# Altium schematic sheet DCDC_Converter.SchDoc
size A4
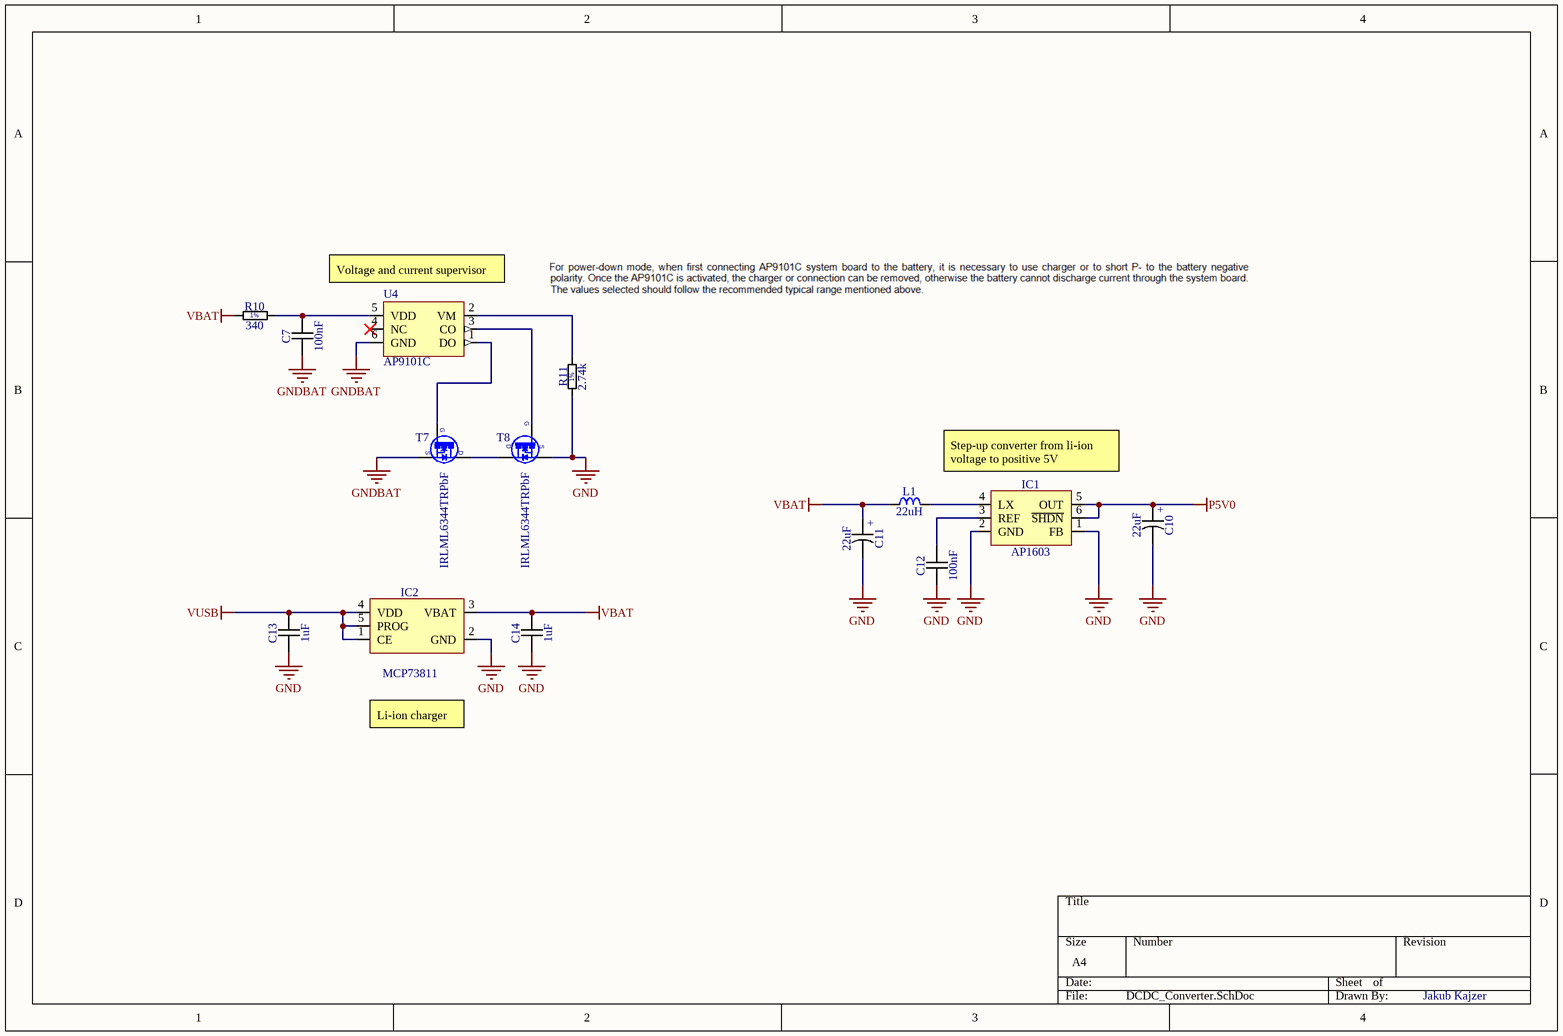
[diagram p0: DCDC_Converter.SchDoc]

## Parts
C7  100nF  [CAPC0402X60N]
C10  22uF  [CAPC2917X310N]
C11  22uF  [CAPC2917X310N]
C12  100nF  [CAPC0603X90N]
C13  1uF  [CAPC0603X90N]
C14  1uF  [CAPC0603X90N]
IC1  AP1603  [SOT26]
IC2  MCP73811  [SOT23-5]
L1  22uH  [INDC1210X150N]
R10  340  [RESC0603X60N]
R11  2.74k  [RESC0603X60N]
T7  IRLML6344TRPbF  [SOT23-3]
T8  IRLML6344TRPbF  [SOT23-3]
U4  AP9101C  [SOT26]

## Nets
GND: C10.2 C11.2 C12.1 C13.1 C14.1 IC1.1(FB) IC1.2(GND) IC2.2(GND) R11.1 T8.2(S)
GNDBAT: C7.1 T7.2(S) U4.6(GND)
P5V0: C10.1 IC1.5(OUT) IC1.6(~{SHDN})
VBAT: C11.1 C14.2 IC2.3(VBAT) L1.1 R10.1
VUSB: C13.2 IC2.1(CE) IC2.4(VDD) IC2.5(PROG)
NetC7_2: C7.2 R10.2 U4.5(VDD)
NetC12_2: C12.2 IC1.3(REF)
NetIC1_4: IC1.4(LX) L1.2
NetR11_2: R11.2 U4.2(VM)
NetT7_1: T7.1(G) U4.1(DO)
NetT7_3: T7.3(D) T8.3(D)
NetT8_1: T8.1(G) U4.3(CO)

Not connected (* = marked no-connect by the designer): U4 4(NC)*

## Notes on the sheet
- Voltage and current supervisor
- Step-up converter from li-ion voltage to positive 5V
- Li-ion charger
- Jakub Kajzer
- (in symbol CC2917_47UF_25V_20%_TANTALUM) +

## Library data of the parts
C7 = CC0402_100NF_16V_10%_X7R: Non-polarised capacitor; Manufacturer: GENERIC; Manufacturer 1 Example: Samsung; Manufacturer 1 Part Number: CL05B104KO5NNNC; Manufacturer 1 Component Height: 0.5mm; PressFit: No; Dielectric: X7R; Tolerance: 10%; Voltage: 16V; DesignItemId: CC0402_100NF_16V_10%_X7R; Author: KB; Case: 0402 (1005 metric); Component Kind: Standard; HelpURL: http://www.farnell.com/datasheets/1870456.pdf?_ga=2.66904750.1666480506.1564307475-778048469.1556931874&_gac=1.242951606.1563147047.EAIaIQobChMIrfuAvMi14wIVB-J3Ch1XegfpEAYYASABEgIMVfD_BwE; Manufacturer Part Number: CC0402_100NF_16V_10%_X7R; Mounted: Yes; Part Description: Non-polarised capacitor; Pin Count: 2; Sense: No; SMD: Yes; Socket: No; Status: Recommended; Value: 100nF; Supplier 1: TME; Supplier 2: Farnell; Supplier 3: Mouser; Create Date: 29.07.2019; LatestRevisionDate: 29.07.2019; Supplier Part Number 1: CL05B104KO5NNNC; Supplier Part Number 2: 1758896; Supplier Part Number 3: 710-885012205037
C10 C11 = CC2917_47UF_25V_20%_TANTALUM: Polarised capacitor; Manufacturer: GENERIC; Manufacturer Part Number: CC2917_22UF_25V_20%_TANTALUM; Manufacturer 1 Example: Vishay; Manufacturer 1 Part Number: 293D476X0025D2TE3; Manufacturer 1 Component Height: 2.8mm; PressFit: No; Tolerance: 20%; Voltage: 25V; DesignItemId: CC2917_47UF_25V_20%_TANTALUM; Author: JK; Case: 2917 (7343 metric); Component Kind: Standard; Footprint: CAPC2917X430N; HelpURL: https://www.tme.eu/Document/a5d90d85079967994fb49c0e8f8ad6e9/293d.pdf; Mounted: Yes; Part Description: Polarised capacitor; Pin Count: 2; Sense: No; SMD: Yes; Socket: No; Status: Recommended; Dielectric: TANTALUM; Value: 22uF; Supplier 1: Mouser; Supplier 2: TME; Create Date: 19.12.2019; LatestRevisionDate: 19.12.2019; Supplier Part Number 1: 74-293D476X0025D2TE3; Supplier Part Number 2: 293D476X0025D2TE3
C12 = CC0603_100NF_16V_10%_X7R: Non-polarised capacitor; Manufacturer: GENERIC; Manufacturer 1 Example: Vishay; Manufacturer 1 Part Number: VJ0603Y104KXJCW1BC; Manufacturer 1 Component Height: 0.8mm; PressFit: No; Dielectric: X7R; Tolerance: 10%; Voltage: 16V; DesignItemId: CC0603_100NF_16V_10%_X7R; Author: KB; Case: 0603 (1608 metric); Component Kind: Standard; HelpURL: https://www.vishay.com/docs/28548/vjw1bcbascomseries.pdf; Manufacturer Part Number: CC0603_100NF_16V_10%_X7R; Mounted: Yes; Part Description: Non-polarised capacitor; Pin Count: 2; Sense: No; SMD: Yes; Socket: No; Status: Recommended; Value: 100nF; Supplier 1: Farnell; Supplier 2: TME; Supplier 3: Mouser; Create Date: 01.04.2019; LatestRevisionDate: 01.04.2019; Supplier Part Number 1: 2896425; Supplier Part Number 2: VJ0603Y104KXJCW1BC; Supplier Part Number 3: 710-885012206046
C13 C14 = CC0603_1UF_6V3_10%_X7R: Non-polarised capacitor; Manufacturer: GENERIC; Manufacturer 1 Example: Samsung; Manufacturer 1 Part Number: C0603C105K9RACAUTO7411; Manufacturer 1 Component Height: 0.8mm; PressFit: No; Dielectric: X7R; Tolerance: 10%; Voltage: 6.3V; DesignItemId: CC0603_1UF_6V3_10%_X7R; Author: UN; Case: 0603 (1608 metric); Component Kind: Standard; HelpURL: https://pl.mouser.com/datasheet/2/212/KEM_C1023_X7R_AUTO_SMD-1093309.pdf; Manufacturer Part Number: CC0603_1UF_6V3_10%_X7R; Mounted: Yes; Part Description: Non-polarised capacitor; Pin Count: 2; Sense: No; SMD: Yes; Socket: No; Status: Recommended; Value: 1uF; Supplier 1: Mouser; Supplier 2: TME; Supplier 3: Farnell; Create Date: 30.08.2019; LatestRevisionDate: 30.08.2019; Supplier Part Number 1: 80-C0603C105K9RAUTLR; Supplier Part Number 2: C0603C105K9RACAU74; Supplier Part Number 3: 2860299
IC1 = AP1603: STEP-UP DC-DC CONVERTER; Manufacturer 1 Example: DIODES INCORPORATED; Manufacturer 1 Part Number: AP1603WG-7; Manufacturer 1 Component Height: 1.3mm; PressFit: No; DesignItemId: AP1603; Author: JK; Device: AP1603; Component Kind: Standard; Footprint: SO26; HelpURL: https://www.tme.eu/Document/3ad0bf81fd35619d65908fe8fa84f929/AP1603x-DTE.pdf; Mounted: Yes; Part Description: STEP-UP DC-DC CONVERTER; Pin Count: 6; Sense: No; SMD: Yes; Socket: No; Supplier 1: Mouser; Supplier 2: Farnell; Supplier 3: TME; Create Date: 19.12.2019; LatestRevisionDate: 19.12.2019; Supplier Part Number 1: 621-AP1603WG-7; Supplier Part Number 2: 1825335; Supplier Part Number 3: AP1603WG-7
IC2 = MCP73811: Simple, Miniature Single-Cell, Fully Integrate d Li-Ion / Li-Polymer Charge Management Controllers; Manufacturer 1 Example: Microchip Technology; Manufacturer 1 Part Number: MCP73811T-420I/OT; Manufacturer 1 Component Height: 1.05mm; PressFit: No; DesignItemId: MCP73811; Author: JK; Device: MCP73811; Component Kind: Standard; HelpURL: https://www.tme.eu/Document/854c2d12dac3548645f8087169cd177d/MCP73811T-420IT.pdf; Mounted: Yes; Part Description: Simple, Miniature Single-Cell, Fully Integrate d Li-Ion / Li-Polymer Charge Management Controllers; Pin Count: 5; Sense: No; SMD: Yes; Socket: No; Supplier 1: TME; Create Date: 20.12.2019; LatestRevisionDate: 20.12.2019; Supplier Part Number 1: MCP73811T-420IT
L1 = IND1210_22UH_150MA: SMD Inductor; Manufacturer: GENERIC; Manufacturer Part Number: LQH32MN220K23L; Manufacturer 1 Example: Murata; Manufacturer 1 Component Height: 2mm; PressFit: No; Tolerance: 10%; DesignItemId: IND1210_22UH_150MA; Author: JK; Case: 1210 (3225 metric); Component Kind: Standard; HelpURL: https://www.murata.com/~/media/webrenewal/support/library/catalog/products/inductor/chip/o05e.ashx; Manufacturer 1 Part Number: LQH32MN220K23L; Mounted: Yes; Part Description: SMD inductor; Pin Count: 2; Sense: No; SMD: Yes; Socket: No; Status: Recommended; Value: 22uH; Supplier 1: Mouser; Supplier 2: TME; Create Date: 19.12.2019; LatestRevisionDate: 19.12.2019; Supplier Part Number 1: 81-LQH32MN220K23L; Supplier Part Number 2: LQH32MN220K23L
R10 = R0603_340R_0.1W_100PPM: General Purpose Thick Film Chip Resistor; Manufacturer: GENERIC; Manufacturer Part Number: R0603_340R_0.0625W 0.1W 0.125W 0.25W 0.5W 1W 0.75W 1W_100PPM; Manufacturer 1 Example: Vishay; Manufacturer 1 Part Number: CRCW0603340RFKEDC; Manufacturer 1 Component Height: 0.5mm; Power: 100mW; Current Max: 0; PressFit: No; TC: ±100 ppm/°C; Tolerance: 1%; Voltage: 75V; DesignItemId: R0603_340R_0.1W_100PPM; Author: KB; Case: 0603 (1608 metric); Component Kind: Standard; Component Type: Standard; HelpURL: https://www.vishay.com/docs/20035/dcrcwe3.pdf; Mounted: Yes; Part Description: General Purpose Thick Film Chip Resistor; Pin Count: 2; Sense: No; SMD: Yes; Socket: No; Status: Recommended; Value: 340; Supplier 1: Farnell; Supplier 2: TME; Supplier 3: Mouser; Create Date: 03.07.2019; LatestRevisionDate: 03.07.2019
R11 = R0603_2K74_0.1W_100PPM: General Purpose Thick Film Chip Resistor; Manufacturer: GENERIC; Manufacturer Part Number: R0603_2K74_0.0625W 0.1W 0.125W 0.25W 0.5W 1W 0.75W 1W_100PPM; Manufacturer 1 Example: Vishay; Manufacturer 1 Part Number: CRCW06032K74FKEDC; Manufacturer 1 Component Height: 0.5mm; Power: 100mW; Current Max: 0; PressFit: No; TC: ±100 ppm/°C; Tolerance: 1%; Voltage: 75V; DesignItemId: R0603_2K74_0.1W_100PPM; Author: KB; Case: 0603 (1608 metric); Component Kind: Standard; Component Type: Standard; HelpURL: https://www.vishay.com/docs/20035/dcrcwe3.pdf; Mounted: Yes; Part Description: General Purpose Thick Film Chip Resistor; Pin Count: 2; Sense: No; SMD: Yes; Socket: No; Status: Recommended; Value: 2.74k; Supplier 1: Farnell; Supplier 2: TME; Supplier 3: Mouser; Create Date: 03.07.2019; LatestRevisionDate: 03.07.2019
T7 T8 = IRLML6344TRPBF: N-MOS 5.0A 29mOhm 30V 2.5V drv capable; Manufacturer 1 Example: Infineon; Manufacturer 1 Component Height: 1.05mm; PressFit: No; DesignItemId: IRLML6344TRPBF; Author: JK; Device: IRLML6344TRPbF; Component Kind: Standard; HelpURL: https://www.tme.eu/Document/f3dfd4e8b214f54a2960ef3507968e9d/irlml6344pbf.pdf; Manufacturer 1 Part Number: IRLML6344TRPBF; Mounted: Yes; Part Description: N-MOS 5.0A 29mOhm 30V 2.5V drv capable; Pin Count: 3; Sense: No; SMD: Yes; Socket: No; Supplier 1: TME; Supplier 2: Farnell; Supplier 3: Mouser; Create Date: 30.09.2019; LatestRevisionDate: 30.09.2019; Supplier Part Number 1: IRLML6344TRPBF; Supplier Part Number 2: 1857299; Supplier Part Number 3: 942-IRLML6344TRPBF
U4 = AP9101C: SINGLE CHIP SOLUTION FOR 1-CELL Li+ BATTERY PACK; Manufacturer 1 Example: Diodes Incorporated; Manufacturer 1 Part Number: AP9101CK6-AETRG1; Manufacturer 1 Component Height: 1.3mm; PressFit: No; DesignItemId: AP9101C; Author: JK; Device: AP9101C; Component Kind: Standard; HelpURL: https://www.tme.eu/Document/2363835cc5634a92b6e94bc773e39f4b/AP9101C.pdf; Mounted: Yes; Part Description: SINGLE CHIP SOLUTION FOR 1-CELL Li+ BATTERY PACK; Pin Count: 6; Sense: No; SMD: Yes; Socket: No; Supplier 1: TME; Create Date: 20.12.2019; LatestRevisionDate: 20.12.2019; Supplier Part Number 1: AP9101CK6-AETRG1